# EAGLE design fab_academy4 (EAGLE 8.0.1)
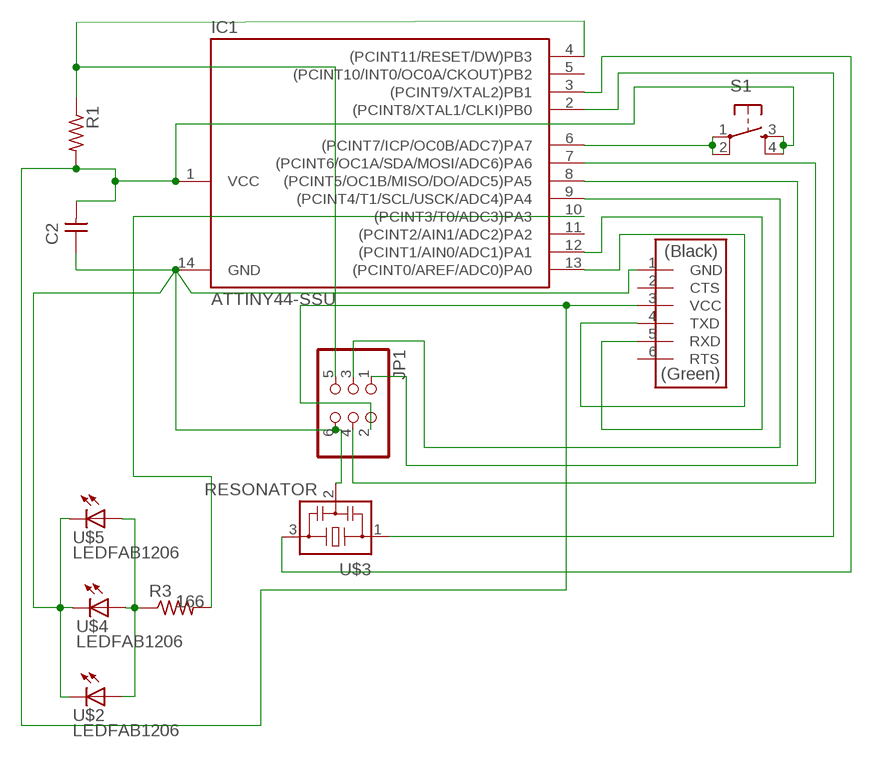
[diagram p0: schematic, sheet 1]

## Parts
C2  CAP-UNPOLARIZEDFAB  [C1206FAB]
IC1  ATTINY44-SSU  [SOIC14]
JP1  PINHD-2X3-SMD  [2X03SMD]
R1  RES-US1206FAB  [R1206FAB]
R3  RES-US1206FAB  [R1206FAB]
S1  6MM_SWITCH6MM_SWITCH  [6MM_SWITCH]
U$1  FTDI-SMD-HEADER  [1X06SMD]
U$2  LEDFAB1206  [LED1206FAB]
U$3  RESONATOR  [EFOBM]
U$4  LEDFAB1206  [LED1206FAB]
U$5  LEDFAB1206  [LED1206FAB]

## Nets
N$1: R3.1 U$2.1(A) U$4.1(A) U$5.1(A)
N$2: IC1.4((PCINT11/RESET/DW)PB3) JP1.5 R1.1
N$3: C2.2 IC1.1(VCC) JP1.2 R1.2 S1.3(S) S1.4(S1) U$1.3(VCC)
N$4: IC1.2((PCINT8/XTAL1/CLKI)PB0) U$3.1
N$5: IC1.3((PCINT9/XTAL2)PB1) U$3.3
N$6: IC1.7((PCINT6/OC1A/SDA/MOSI/ADC6)PA6) JP1.4
N$8: IC1.8((PCINT5/OC1B/MISO/DO/ADC5)PA5) JP1.1
N$9: IC1.9((PCINT4/T1/SCL/USCK/ADC4)PA4) JP1.3
N$10: IC1.12((PCINT1/AIN0/ADC1)PA1) U$1.5(RXD)
N$11: IC1.13((PCINT0/AREF/ADC0)PA0) U$1.4(TXD)
N$12: C2.1 IC1.14(GND) JP1.6 U$1.1(GND) U$2.2(C) U$3.2 U$4.2(C) U$5.2(C)
N$16: IC1.6((PCINT7/ICP/OC0B/ADC7)PA7) S1.1(P) S1.2(P1)
N$18: IC1.10((PCINT3/T0/ADC3)PA3) R3.2
Unconnected: IC1.5((PCINT10/INT0/OC0A/CKOUT)PB2) IC1.11((PCINT2/AIN1/ADC2)PA2) U$1.2(CTS) U$1.6(RTS)

## Library data of the parts
C2 = fab:CAP-UNPOLARIZED
IC1 = fab:ATTINY44
JP1 = fab:PINHD-2X3-SMD: PIN HEADER
R1 = fab:RES-US: Resistor (US Symbol) Variants with postfix FAB are widened to allow the routing of internal traces
R3 = fab:RES-US: Resistor (US Symbol) Variants with postfix FAB are widened to allow the routing of internal traces; RESISTOR: 166
S1 = fab:6MM_SWITCH: OMRON SWITCH
U$1 = fab:FTDI-SMD-HEADER
U$2 U$4 U$5 = fab:LED: LED
U$3 = fab:RESONATOR

## Net classes
0 default: width 0.01 mm, clearance 0.4 mm

## Board
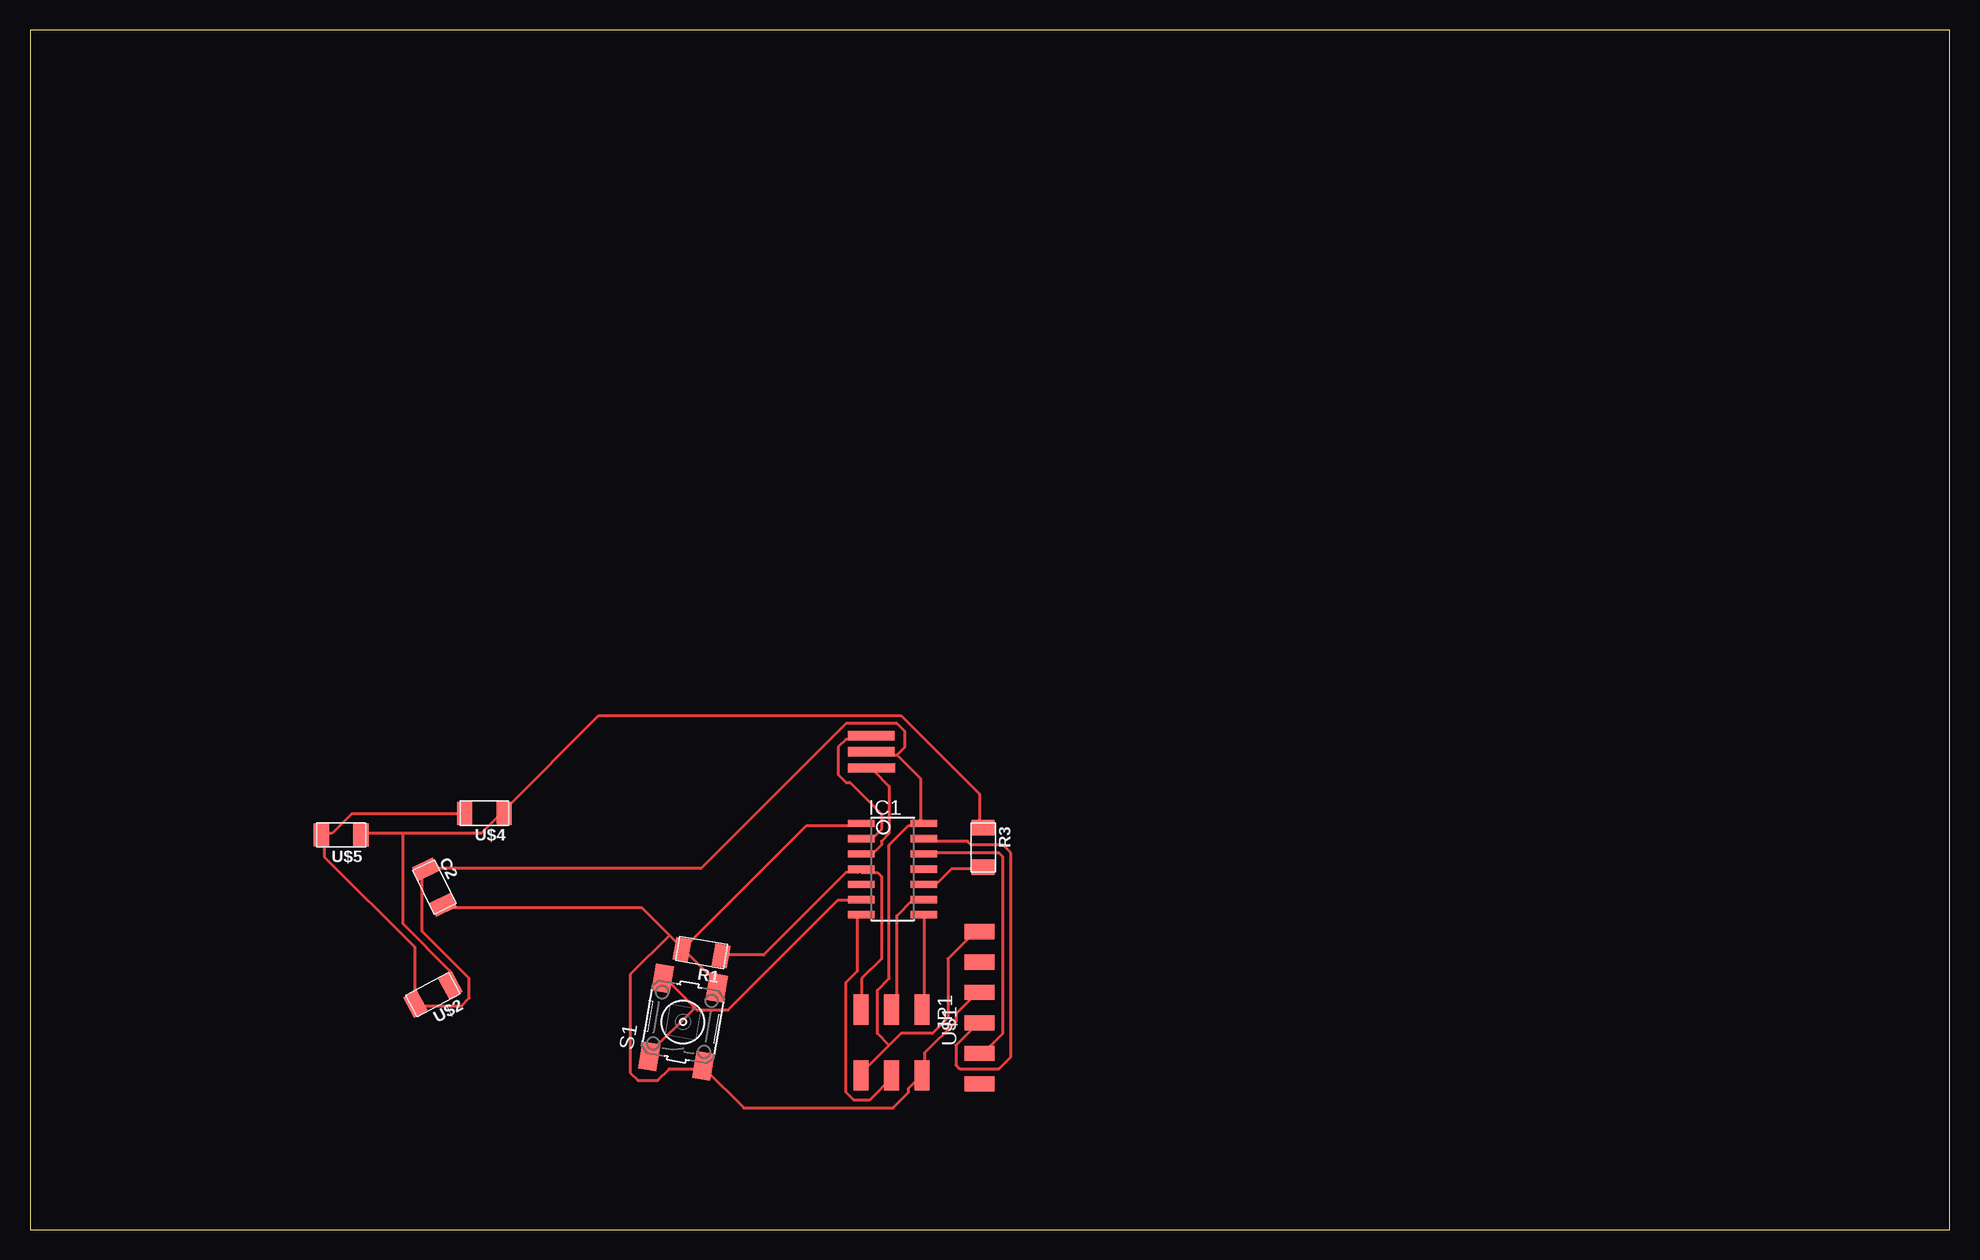
[diagram p1: board, top side]

Size 160 x 100 mm. Coordinates in mm from the lower left corner, seen from the top.
Outline: 0,0 160,0 160,100 0,100 0,0
Copper layers (1*16): Top 0.035mm / dielectric 1.5mm / Bottom 0.035mm
Design rules "default": minimum track width 10mil, minimum drill 24mil, track to track 8mil, track to pad 8mil, pad to pad 8mil, via to via 8mil, smd to smd 8mil, copper to edge 40mil, drill to drill 8mil, minimum pad ring 10mil, minimum via ring 8mil, stop-mask expansion 4mil, vias tented up to drill 0mil, thermal gap 10mil

### Footprints (pad centres in the part's own frame; a part is rotated, then mirrored left to right if it is on the bottom)
C1206FAB = smd 1.27 x 1.905: 1 -1.651,0; 2 1.651,0
SOIC14 = smd 0.61 x 2.21: 1 -3.81,-2.603; 2 -2.54,-2.603; 3 -1.27,-2.603; 4 0,-2.603; 5 1.27,-2.603; 6 2.54,-2.603; 7 3.81,-2.603; 8 3.81,2.603; 9 2.54,2.603; 10 1.27,2.603; 11 0,2.603; 12 -1.27,2.603; 13 -2.54,2.603; 14 -3.81,2.603
2X03SMD = smd 2.54 x 1.27: 1 -2.54,2.54; 2 2.92,2.54; 3 -2.54,0; 4 2.92,0; 5 -2.54,-2.54; 6 2.92,-2.54
R1206FAB = smd 1.27 x 1.905: 1 -1.651,0; 2 1.651,0
6MM_SWITCH = smd 2.286 x 1.524: 1 -3.302,2.286; 2 3.302,2.286; 3 -3.302,-2.286; 4 3.302,-2.286
1X06SMD = smd 2.54 x 1.27: 1 0,6.35; 2 0,3.81; 3 0,1.27; 4 0,-1.27; 5 0,-3.81; 6 0,-6.35
LED1206FAB = smd 1.27 x 1.905: 1 -1.651,0; 2 1.651,0
EFOBM = smd 0.8 x 3.9: 1 -1.35,0; 2 0,0; 3 1.35,0

### Placement (x,y rotation side)
C2  33.71,28.55 296.1 top
IC1  71.91,30.05 270 top
JP1  71.81,15.77 270 top
R1  55.98,23.09 170.4 top
R3  79.45,31.85 270 top
S1  54.43,17.3 80.2 top
U$1  79.15,18.49 0 top
U$2  33.58,19.58 208.3 top
U$3  70.13,39.83 270.4 top
U$4  37.87,34.7 180 top
U$5  25.93,32.89 180 top

### Tracks (layer width: path | path; a pad name or v marks a point on that pad's centre or on a via)
N$1
  Top 0.254: 31.07,33.03 37.6,33.03 39.24,34.66 U$4.1 39.57,34.99 47.41,42.84 72.59,42.84 79.13,36.3 79.13,33.68 R3.1 | 31.07,33.03 27.8,33.03 U$5.1 | 31.07,33.03 31.07,25.51 34.99,21.58 34.99,20.6 U$2.1
N$2
  Top 0.254: R1.1 57.88,22.89 61.15,22.89 68.02,29.76 69,29.76 IC1.4 69.32,29.76 70.63,29.76 70.96,29.43 70.96,22.56 69.32,20.93 69.32,18.64 JP1.5
N$3
  Top 0.254: U$1.3 79.13,19.95 77.17,17.98 77.17,17.33 74.56,14.71 74.56,13.08 JP1.2 74.23,12.75 73.25,11.77 73.25,11.45 71.94,10.14 59.51,10.14 56.24,13.41 S1.3 55.92,13.41 53.3,13.41 52.32,12.43 50.69,12.43 50.03,13.08 50.03,21.25 53.3,24.52 | R1.2 54.61,23.22 57.55,20.27 S1.4 | 53.3,24.52 54.28,23.54 R1.2 | 53.3,24.52 51.01,26.81 34.66,26.81 C2.2 | IC1.1 69,33.68 64.75,33.68 54.61,23.54 R1.2
N$4
  Top 0.254: IC1.2 69.32,32.7 70.31,32.7 70.96,33.35 70.96,34.66 68.34,37.28 68.02,37.28 67.36,37.93 67.36,40.22 68.02,40.88 69.98,40.88 U$3.1
N$5
  Top 0.254: IC1.3 69.32,31.39 70.31,31.39 70.96,32.05 70.96,32.37 71.61,33.03 71.61,36.95 70.31,38.26 U$3.3
N$6
  Top 0.254: IC1.7 69,26.16 69,21.58 68.02,20.6 68.02,11.45 68.67,10.79 69.98,10.79 71.94,12.75 JP1.4
N$8
  Top 0.254: IC1.8 74.56,26.16 74.56,18.64 JP1.1
N$9
  Top 0.254: IC1.9 74.23,27.47 73.58,27.47 72.27,26.16 72.27,18.97 71.94,18.64 JP1.3
N$10
  Top 0.254: IC1.12 74.56,31.39 80.77,31.39 81.1,31.07 81.1,16.35 79.46,14.71 U$1.5
N$11
  Top 0.254: IC1.13 74.56,32.37 78.15,32.37 78.48,32.05 81.1,32.05 81.75,31.39 81.75,14.39 80.77,13.41 77.5,13.41 77.17,13.73 77.17,15.37 79.13,17.33 U$1.4
N$12
  Top 0.254: U$4.2 35.97,34.66 26.81,34.66 25.18,33.03 24.52,33.03 U$5.2 24.52,32.7 24.52,31.07 32.05,23.54 32.05,18.97 U$2.2 32.37,18.64 35.97,18.64 36.62,19.29 36.62,20.93 32.7,24.85 32.7,29.76 C2.1 33.03,30.08 55.92,30.08 68.02,42.18 72.27,42.18 72.92,41.53 72.92,40.22 72.27,39.57 | 72.27,39.57 74.23,37.6 74.23,34.01 IC1.14 74.23,33.68 73.25,33.68 71.61,32.05 71.61,20.93 70.63,19.95 70.63,16.35 71.61,15.37 | 72.27,39.57 70.31,39.57 U$3.2 | 71.61,15.37 72.59,16.35 75.21,16.35 76.52,17.66 76.52,22.56 78.48,24.52 79.13,24.52 U$1.1 | 71.61,15.37 69.32,13.08 JP1.6
N$16
  Top 0.254: 55.26,18.64 52.97,20.93 S1.2 | 55.26,18.64 55.59,18.31 58.21,18.31 67.36,27.47 69,27.47 IC1.6 | 55.26,18.64 55.26,18.31 51.67,14.71 S1.1
N$18
  Top 0.254: R3.2 79.13,30.08 76.84,30.08 75.54,28.78 74.56,28.78 IC1.10

### Text on the board
202bmp: C:/Users/Mahavir Singh/Desktop/Week 6/corbu.bmp